# Altium schematic sheet W5500_Module.SchDoc: RP2040 CNC
size B; Author: AM; CompanyName: Expatria Technologies; DrawnBy: A.Marles; Engineer: AM; Organization: Expatria Technolgoies; Address1: Schematic; DocumentNumber: 2; SheetNumber: 5; SheetTotal: 9
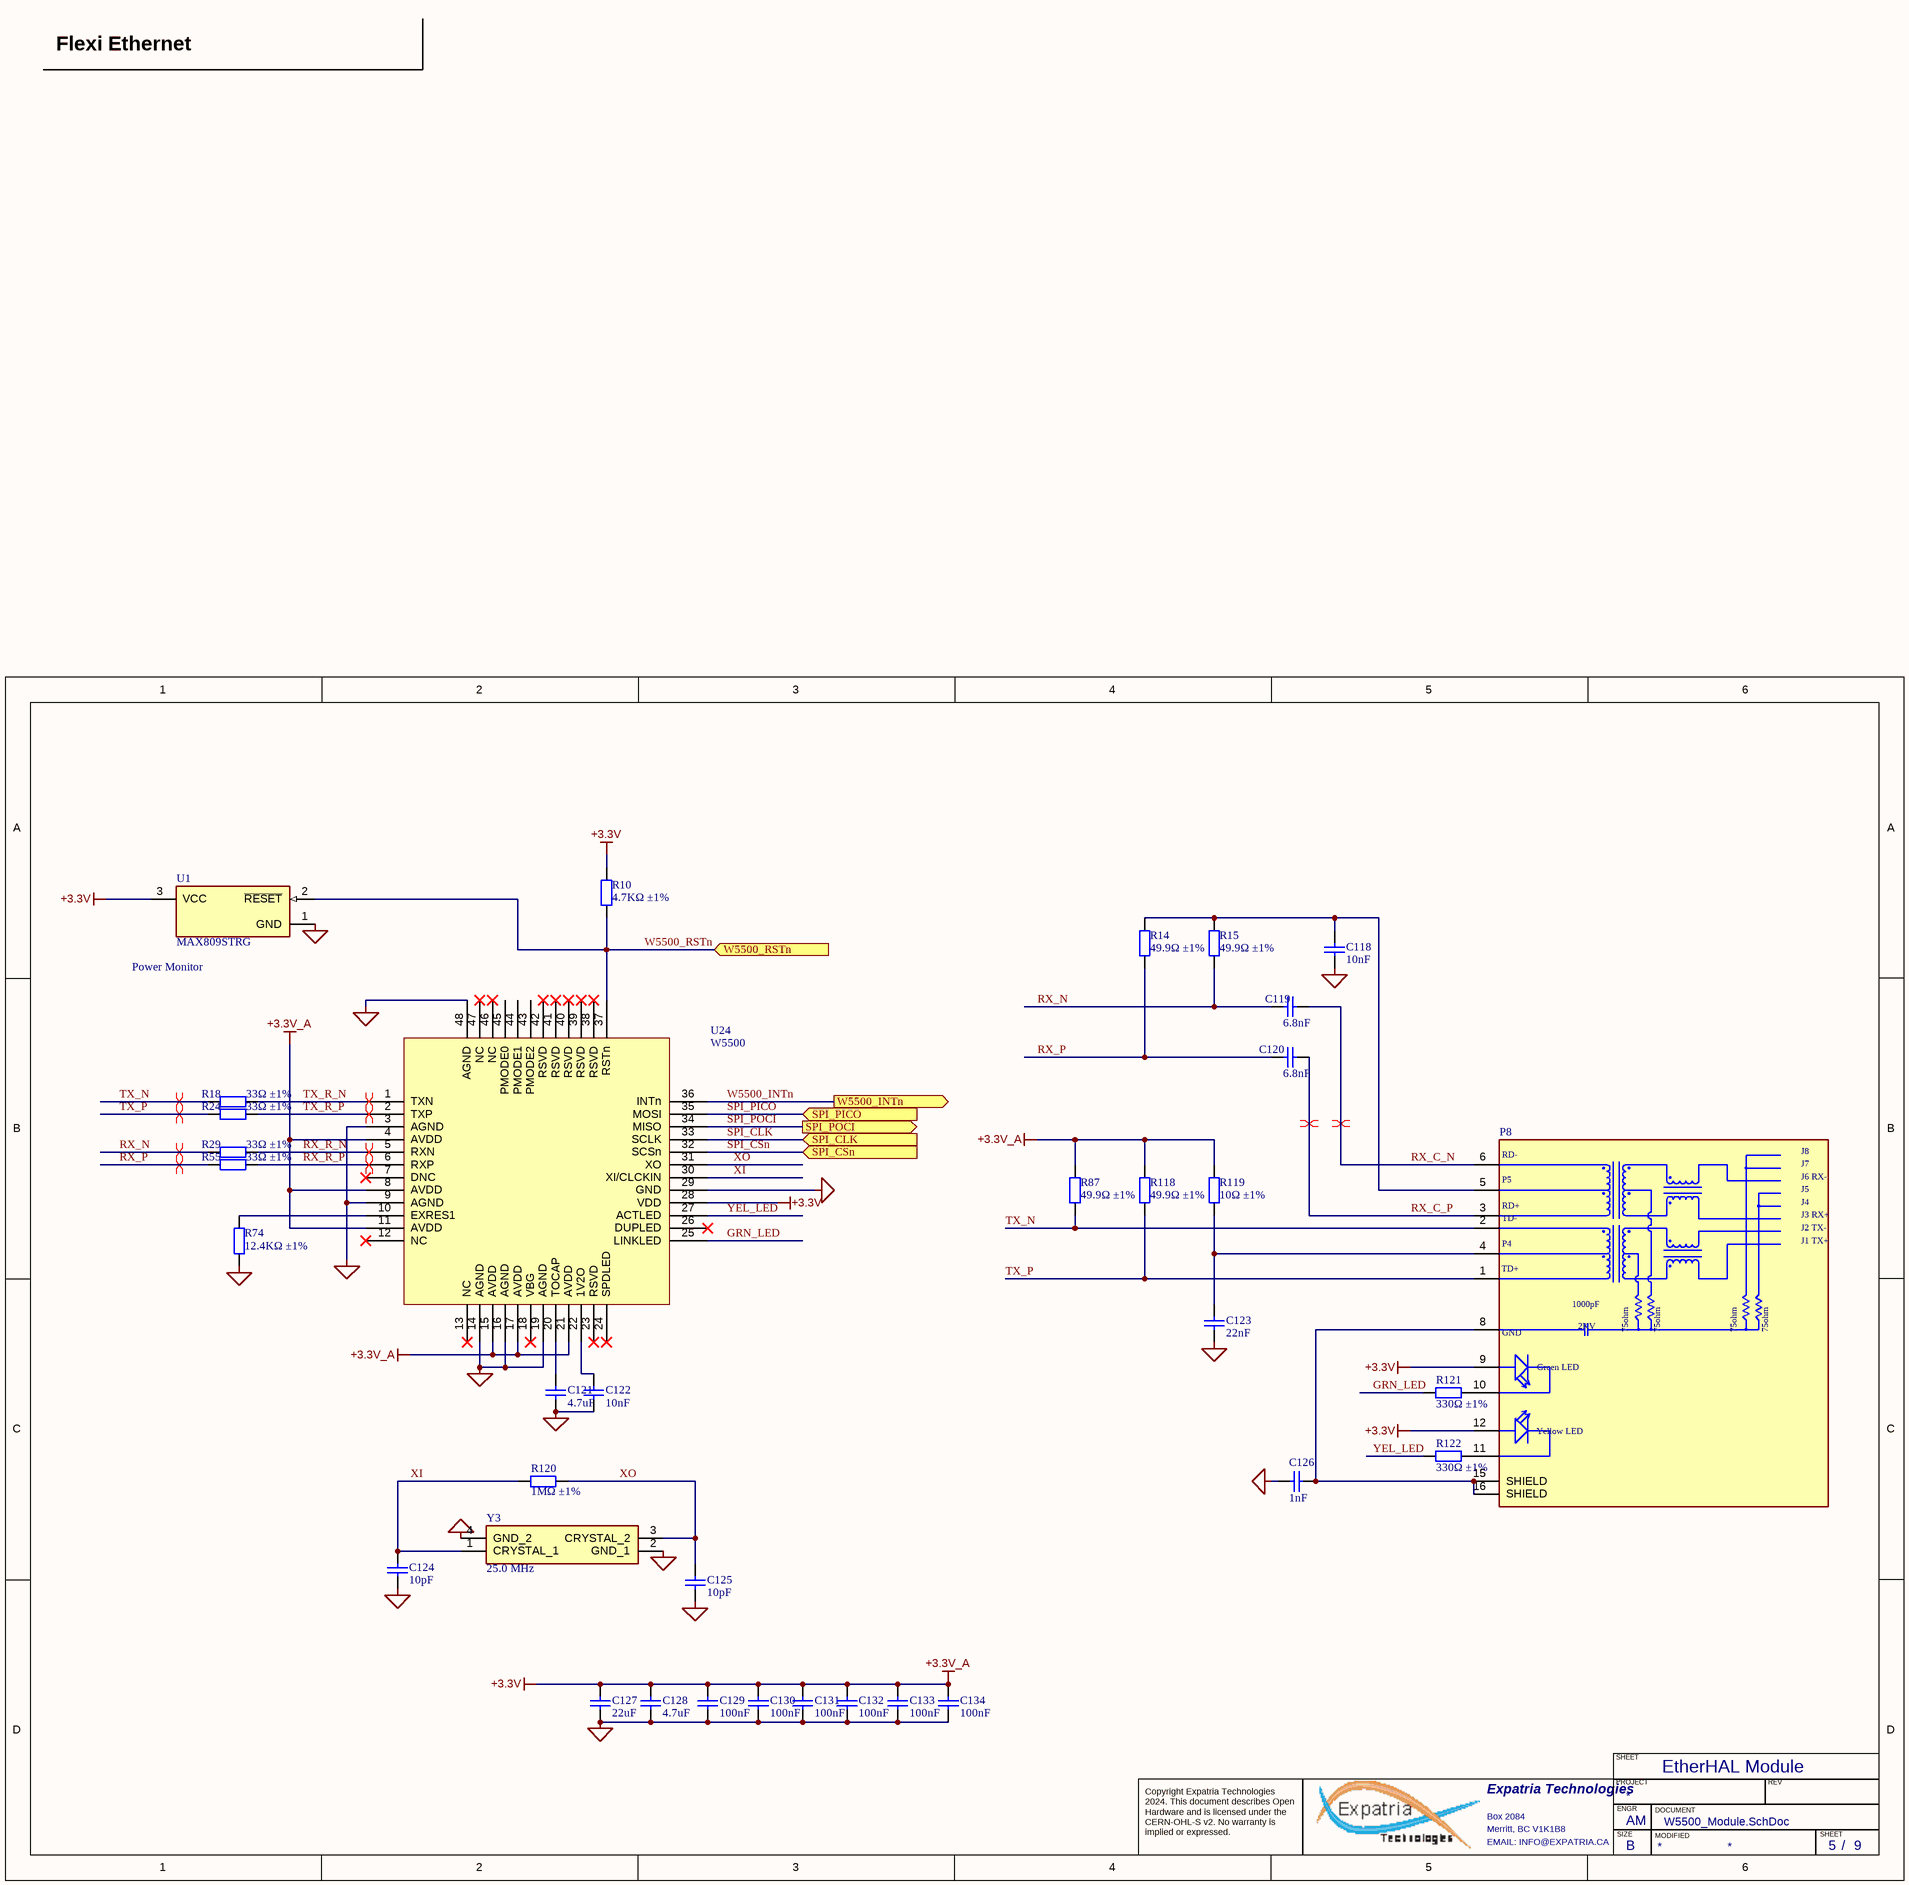
[diagram p0: W5500_Module.SchDoc]

## Parts
C118  10nF  [0402_C]
C119  6.8nF  [0402_C]
C120  6.8nF  [0402_C]
C121  4.7uF  [0402_C]
C122  10nF  [0402_C]
C123  22nF  [0402_C]
C124  10pF  [0402_C]
C125  10pF  [0402_C]
C126  1nF  [1206_C]
C127  22uF  [0805_C]
C128  4.7uF  [0603_C]
C129  100nF  [0402_C]
C130  100nF  [0402_C]
C131  100nF  [0402_C]
C132  100nF  [0402_C]
C133  100nF  [0402_C]
C134  100nF  [0402_C]
P8  (no value)  [HANRUN_HR911105A]
R10  4.7KΩ ±1%  [0402_R]
R14  49.9Ω ±1%  [0402_R]
R15  49.9Ω ±1%  [0402_R]
R18  33Ω ±1%  [0402_R]
R24  33Ω ±1%  [0402_R]
R29  33Ω ±1%  [0402_R]
R55  33Ω ±1%  [0402_R]
R74  12.4KΩ ±1%  [0603_R]
R87  49.9Ω ±1%  [0402_R]
R118  49.9Ω ±1%  [0402_R]
R119  10Ω ±1%  [0402_R]
R120  1MΩ ±1%  [0402_R]
R121  330Ω ±1%  [0402_R]
R122  330Ω ±1%  [0402_R]
U1  MAX809STRG  [FP-318-08-MFG]
U24  W5500  [LQFP-48_7x7x05P]
Y3  25.0 MHz  [YSX321SL]

## Ports
SPI_CLK (in), SPI_CSn (in), SPI_PICO (in), SPI_POCI (out), W5500_INTn (out), W5500_RSTn (in)

## Nets
+3.3V: C127.2 C128.2 C129.2 C130.2 C131.2 C132.2 C133.2 C134.2 P8.9(GA) P8.12(YA) R10.1 R87.1 R118.1 R119.1 U1.3(VCC) U24.4(AVDD) U24.8(AVDD) U24.11(AVDD) U24.15(AVDD) U24.17(AVDD) U24.21(AVDD) U24.28(VDD)  [also labelled +3.3V_A]
MCU_GND: C118.1 C121.1 C122.1 C123.1 C124.1 C125.1 C126.1 C127.1 C128.1 C129.1 C130.1 C131.1 C132.1 C133.1 C134.1 R74.1 U1.1(GND) U24.3(AGND) U24.9(AGND) U24.14(AGND) U24.16(AGND) U24.19(AGND) U24.29(GND) U24.48(AGND) Y3.2(GND_1) Y3.4(GND_2)
GRN_LED: R121.1 U24.25(LINKLED)
RX_C_N: C119.1 P8.6(RD-)
RX_C_P: C120.1 P8.3(RD+)
RX_N: C119.2 R15.2 R29.1
RX_P: C120.2 R14.2 R55.1
RX_R_N: R29.2 U24.5(RXN)
RX_R_P: R55.2 U24.6(RXP)
SPI_CLK: U24.33(SCLK) ; port SPI_CLK
SPI_CSn: U24.32(SCSn) ; port SPI_CSn
SPI_PICO: U24.35(MOSI) ; port SPI_PICO
SPI_POCI: U24.34(MISO) ; port SPI_POCI
TX_N: P8.2(TD-) R18.1 R87.2
TX_P: P8.1(TD+) R24.1 R118.2
TX_R_N: R18.2 U24.1(TXN)
TX_R_P: R24.2 U24.2(TXP)
W5500_INTn: U24.36(INTn) ; port W5500_INTn
W5500_RSTn: R10.2 U1.2(~{RESET}) U24.37(RSTn) ; port W5500_RSTn
XI: C124.2 R120.1 U24.30(XI/CLCKIN) Y3.1(CRYSTAL_1)
XO: C125.2 R120.2 U24.31(XO) Y3.3(CRYSTAL_2)
YEL_LED: R122.1 U24.27(ACTLED)
NetC118_2: C118.2 P8.5(P5) R14.1 R15.1
NetC121_2: C121.2 U24.20(TOCAP)
NetC122_2: C122.2 U24.22(1V2O)
NetC123_2: C123.2 P8.4(P4) R119.2
NetC126_2: C126.2 P8.8(GND) P8.15(SHIELD) P8.16(SHIELD)
NetP8_10: P8.10(GC) R121.2
NetP8_11: P8.11(YC) R122.2
NetR74_2: R74.2 U24.10(EXRES1)

Not connected (* = marked no-connect by the designer): U24 7(DNC)* 12(NC)* 13(NC)* 18(VBG)* 23(RSVD)* 24(SPDLED)* 26(DUPLED)* 38(RSVD)* 39(RSVD)* 40(RSVD)* 41(RSVD)* 42(RSVD)* 43(PMODE2) 44(PMODE1) 45(PMODE0) 46(NC)* 47(NC)*

## Layout directives
differential pair: RX_C_N, RX_C_P, RX_N, RX_P, RX_R_N, RX_R_P, TX_N, TX_P, TX_R_N, TX_R_P

## Notes on the sheet
- Flexi Ethernet
- (near U1) Power Monitor
- EtherHAL Module
- SHEET
- Expatria Technologies
- Box 2084
- Merritt, BC V1K1B8
- PROJECT
- SIZE
- ENGR
- MODIFIED
- DOCUMENT
- REV
- Copyright Expatria Technologies 2024. This document describes Open Hardware and is licensed under the CERN-OHL-S v2. No warranty is implied or expressed.
- EMAIL: INFO@EXPATRIA.CA
- B
- /
- (in symbol HR911105A) J8; J7; J6 RX-; J5; J4; J3 RX+; J2 TX-; J1 TX+; 1000pF; 2KV; 75ohm; Green LED; Yellow LED

## Library data of the parts
C118 C122 = 0402 10nF (103) 10% 50V: Chip capacitors; Manufacturer: Samsung Electro-Mechanics; PartNumber: CL05B103KB5NNNC; Tolerance: 10%; Voltage: 50V; ComponentLink1Description: Supplier link; ComponentLink1URL: http://www.szlcsc.com/product/details_15869.html; Package: 0402; Supplier: LC; SuppliersPartNumber: C15195; Capacitance: 10nF
C119 C120 = 0402 6.8nF (682) 10% 50V: Chip capacitors; Manufacturer: Guangdong Fenghua Advanced Tech; PartNumber: 0402B682K500NT; Tolerance: 10%; Voltage: 50V; ComponentLink1Description: Supplier link; ComponentLink1URL: http://www.szlcsc.com/product/details_1894.html; Package: 0402; Supplier: LC; SuppliersPartNumber: C1542; Capacitance: 6.8nF
C121 = 0402 4.7uF (475) 20% 10V: Chip capacitor; Manufacturer: Samsung Electro-Mechanics; PartNumber: CL05A475MP5NRNC; Tolerance: 20%; Voltage: 10V; ComponentLink1Description: Supplier link; ComponentLink1URL: http://www.szlcsc.com/product/details_24469.html; Package: 0402; Supplier: LC; SuppliersPartNumber: C23733; Capacitance: 4.7uF
C123 = 0402 22nF (223) 10% 50V: Chip capacitors; Manufacturer: Guangdong Fenghua Advanced Tech; PartNumber: 0402B223K500NT; Tolerance: 10%; Voltage: 50V; ComponentLink1Description: Supplier link; ComponentLink1URL: http://www.szlcsc.com/product/details_1884.html; Package: 0402; Supplier: LC; SuppliersPartNumber: C1532; Capacitance: 22nF
C124 C125 = 0402 10pF (100) 5% 50V: Chip capacitors; Manufacturer: Samsung Electro-Mechanics; PartNumber: CL05C100JB5NNNC; Tolerance: 5%; Voltage: 50V; ComponentLink1Description: Supplier link; ComponentLink1URL: http://www.szlcsc.com/product/details_33914.html; Package: 0402; Supplier: LC; SuppliersPartNumber: C32949; Capacitance: 10pF
C126 = 1206 1nF (102) 10% 500V: Chip capacitors; Manufacturer: Samsung Electro-Mechanics; PartNumber: CL31B102KGFNNNE; Tolerance: 10%; Voltage: 500V; ComponentLink1Description: Supplier link; ComponentLink1URL: http://www.szlcsc.com/product/details_36187.html; Package: 1206; Supplier: LC; SuppliersPartNumber: C35216; Capacitance: 1nF
C127 = 0805 22uF (226) 20% 25V: Chip capacitors; Manufacturer: Samsung Electro-Mechanics; PartNumber: CL21A226MAQNNNE; Tolerance: 20%; Voltage: 25V; ComponentLink1Description: Supplier link; ComponentLink1URL: http://www.szlcsc.com/product/details_46786.html; Package: 0805; Supplier: LC; SuppliersPartNumber: C2922481; Capacitance: 22uF
C128 = 0603 4.7uF (475) 10% 16V: Chip capacitors; Manufacturer: Samsung Electro-Mechanics; PartNumber: CL10A475KO8NNNC; Tolerance: 10%; Voltage: 16V; ComponentLink1Description: Supplier link; ComponentLink1URL: http://www.szlcsc.com/product/details_20375.html; Package: 0603; Supplier: LC; SuppliersPartNumber: C19666; Capacitance: 4.7uF
C129-C134 = 0402 100nF (104) 10% 16V: Chip capacitors; Manufacturer: Samsung Electro-Mechanics; PartNumber: CL05B104KO5NNNC; Tolerance: 10%; Voltage: 16V; ComponentLink1Description: Supplier link; ComponentLink1URL: http://www.szlcsc.com/product/details_1877.html; Package: 0402; Supplier: LC; SuppliersPartNumber: C1525; Capacitance: 100nF
P8 = HR911105A: HR911105A Ethernet Interface Arduino Platform Evaluation Expansion Board; MF: DFRobot; SuppliersPartNumber: C163507; Package: None; Availability: Unavailable; MP: HR911105A; Value: *; Price: None
R10 = 0402 4.7K (4701) 1%: Chip resistor; Manufacturer: Uniroyal Elec; PartNumber: 0402WGF4701TCE; Power: 1/16W; ComponentLink1Description: Supplier link; ComponentLink1URL: http://www.szlcsc.com/product/details_26643.html; Package: 0402; Supplier: LC; SuppliersPartNumber: C25900; Resistance: 4.7KΩ; Tolerance: 1%
R14 R15 R87 R118 = 0402 49.9R (49R9) 1%: Chip resistor; Manufacturer: Uniroyal Elec; PartNumber: 0402WGF499JTCE; Power: 1/16W; ComponentLink1Description: Supplier link; ComponentLink1URL: http://www.szlcsc.com/product/details_25863.html; Package: 0402; Supplier: LC; SuppliersPartNumber: C25120; Resistance: 49.9Ω; Tolerance: 1%
R18 R24 R29 R55 = 0402 33R (33R0) 1%: Chip resistor; Manufacturer: Uniroyal Elec; PartNumber: 0402WGF330JTCE; Power: 1/16W; ComponentLink1Description: Supplier link; ComponentLink1URL: http://www.szlcsc.com/product/details_25848.html; Package: 0402; Supplier: LC; SuppliersPartNumber: C25105; Resistance: 33Ω; Tolerance: 1%
R74 = 0603 10K (1002) 1%: Chip resistor; Manufacturer: Uniroyal Elec; PartNumber: 0603WAF1242T5E; Power: 1/10W; Resistance: 12.4K; ComponentLink1Description: Supplier link; ComponentLink1URL: http://www.szlcsc.com/product/details_26547.html; Package: 0603; Supplier: LC; SuppliersPartNumber: C22865; Tolerance: 1%
R119 = 0402 10R (10R0) 1%: Chip resistor; Manufacturer: Uniroyal Elec; PartNumber: 0402WGF100JTCE; Power: 1/16W; ComponentLink1Description: Supplier link; ComponentLink1URL: http://www.szlcsc.com/product/details_25820.html; Package: 0402; Supplier: LC; SuppliersPartNumber: C25077; Resistance: 10Ω; Tolerance: 1%
R120 = 0402 1M (1004) 1%: Chip resistor; Manufacturer: Uniroyal Elec; PartNumber: 0402WGF1004TCE; Power: 1/16W; ComponentLink1Description: Supplier link; ComponentLink1URL: http://www.szlcsc.com/product/details_26826.html; Package: 0402; Supplier: LC; SuppliersPartNumber: C26083; Resistance: 1MΩ; Tolerance: 1%
R121 R122 = 0402 330R (3300) 1%: Chip resistor; Manufacturer: Uniroyal Elec; PartNumber: 0402WGF3300TCE; Power: 1/16W; ComponentLink1Description: Supplier link; ComponentLink1URL: http://www.szlcsc.com/product/details_25847.html; Package: 0402; Supplier: LC; SuppliersPartNumber: C25104; Resistance: 330Ω; Tolerance: 1%
U1 = CMP-07130-000007-1: IC MPU SUPERVISORY 2.93V SOT23; Manufacturer: ON SEMICONDUCTOR; Number Of Outputs: 1; Nominal Supply Current: 0.5-0.8uA; Min Supply Voltage: 1V; Max Junction Temp: +125°C; Max Supply Voltage: 5.5V; Reset Timeout: 10us; Output Current: 20mA; Output Voltage: 0.3V; Reset Type: Active Low; Standoff Height: 0.01mm; Octopart: https://octopart.com/max809strg-on+semiconductor-509853; Category: IC; Temperature: -40°C to +125°C; Temperature Range Low: -40°C; ComponentLink2URL: https://www.onsemi.cn/PowerSolutions/document/MAX809S-D.PDF; Device Class L1: Integrated Circuits (ICs); Automotive: No; Package: 318-08; Device Class L2: Power Management ICs; RoHS: TRUE; Height: 1.11mm; Digikey Description: IC MPU SUPERVISORY 2.93V SOT23; Mouser Description: Supervisory Circuits 2.93V uP Reset; ComponentLink2Description: Datasheet; Manufacturer Part Number: MAX809STRG; Temperature Range High: +125°C; Number Of Rails Monitored: 1; Threshold Voltage: 2.93V; Footprint Url: https://www.onsemi.com/pub/Collateral/318-08.PDF; Device Class L3: Voltage Supervisors; Lead Free: Yes; SuppliersPartNumber: C9965
U24 = W5500_[C32843]: Ethernet Controllers 2.97V ~ 3.63V 10/100 Base-T/TX PHY SPI LQFP-48_7x7x05P Ethernet ICs ROHS; ComponentLink1Description: 供应商链接; ComponentLink1URL: http://www.szlcsc.com/product/details_33808.html; Package: LQFP-48_7x7x05P; Supplier: LC; SuppliersPartNumber: C32843
Y3 = YSX321SL: Crystal or Oscillator; Manufacturer_Name: Yangxing Tech; Manufacturer_Part_Number: X322525MSB4SI; Height: 0.8mm; SuppliersPartNumber: C13740